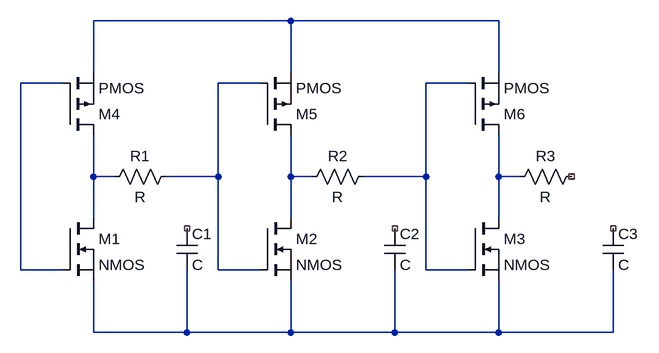
[diagram p0: schematic Draft3.asc]
Draft3.asc, the LTspice schematic file:
Version 4
SHEET 1 892 680
WIRE 352 -96 48 -96
WIRE 672 -96 352 -96
WIRE 48 -16 48 -96
WIRE 352 -16 352 -96
WIRE 672 -16 672 -96
WIRE 0 0 -64 0
WIRE 304 0 240 0
WIRE 624 0 560 0
WIRE 48 144 48 80
WIRE 80 144 48 144
WIRE 240 144 240 0
WIRE 240 144 160 144
WIRE 352 144 352 80
WIRE 384 144 352 144
WIRE 560 144 560 0
WIRE 560 144 464 144
WIRE 672 144 672 80
WIRE 704 144 672 144
WIRE 48 208 48 144
WIRE 352 208 352 144
WIRE 672 208 672 144
WIRE -64 288 -64 0
WIRE 0 288 -64 288
WIRE 240 288 240 144
WIRE 304 288 240 288
WIRE 560 288 560 144
WIRE 624 288 560 288
WIRE 48 384 48 304
WIRE 192 384 192 288
WIRE 192 384 48 384
WIRE 352 384 352 304
WIRE 352 384 192 384
WIRE 512 384 512 288
WIRE 512 384 352 384
WIRE 672 384 672 304
WIRE 672 384 512 384
WIRE 848 384 848 288
WIRE 848 384 672 384
SYMBOL nmos 0 208 R0
SYMATTR InstName M1
SYMBOL nmos 304 208 R0
SYMATTR InstName M2
SYMBOL nmos 624 208 R0
SYMATTR InstName M3
SYMBOL pmos 0 80 M180
SYMATTR InstName M4
SYMBOL pmos 304 80 M180
SYMATTR InstName M5
SYMBOL pmos 624 80 M180
SYMATTR InstName M6
SYMBOL res 176 128 R90
WINDOW 0 0 56 VBottom 2
WINDOW 3 32 56 VTop 2
SYMATTR InstName R1
SYMBOL res 480 128 R90
WINDOW 0 0 56 VBottom 2
WINDOW 3 32 56 VTop 2
SYMATTR InstName R2
SYMBOL res 800 128 R90
WINDOW 0 0 56 VBottom 2
WINDOW 3 32 56 VTop 2
SYMATTR InstName R3
SYMBOL cap 176 224 R0
SYMATTR InstName C1
SYMBOL cap 496 224 R0
SYMATTR InstName C2
SYMBOL cap 832 224 R0
SYMATTR InstName C3

The netlist it stands for:
* Draft3.asc
M1 N005 N002 N008 N008 NMOS
M2 N006 N003 N008 N008 NMOS
M3 N007 N004 N008 N008 NMOS
M4 N005 N002 N001 N001 PMOS
M5 N006 N003 N001 N001 PMOS
M6 N007 N004 N001 N001 PMOS
R1 N003 N005 R
R2 N004 N006 R
R3 NC_01 N007 R
C1 NC_02 N008 C
C2 NC_03 N008 C
C3 NC_04 N008 C
.model NMOS NMOS
.model PMOS PMOS
.lib standard.mos
.backanno
.end